# EasyEDA Pro project Ctrller v1.epro

# Schematic Controller
Board Name: Controller; Create Date: 2025-12-16; Page Name: Controller; Project Name: Renesas HandSync; Schematic Name: Controller; Update Date: 2025-12-22; BladeWidth: 10; Company: CQUPT; Drawed: WilliTourt; Page Size: A4; RegionStart: 1; Reviewed: WilliTourt; ShowBorder: 1; TitleBlock: 1; TitleBlockPosition: 3; Version: V1.0; XRegionCount: 6; YRegionCount: 4
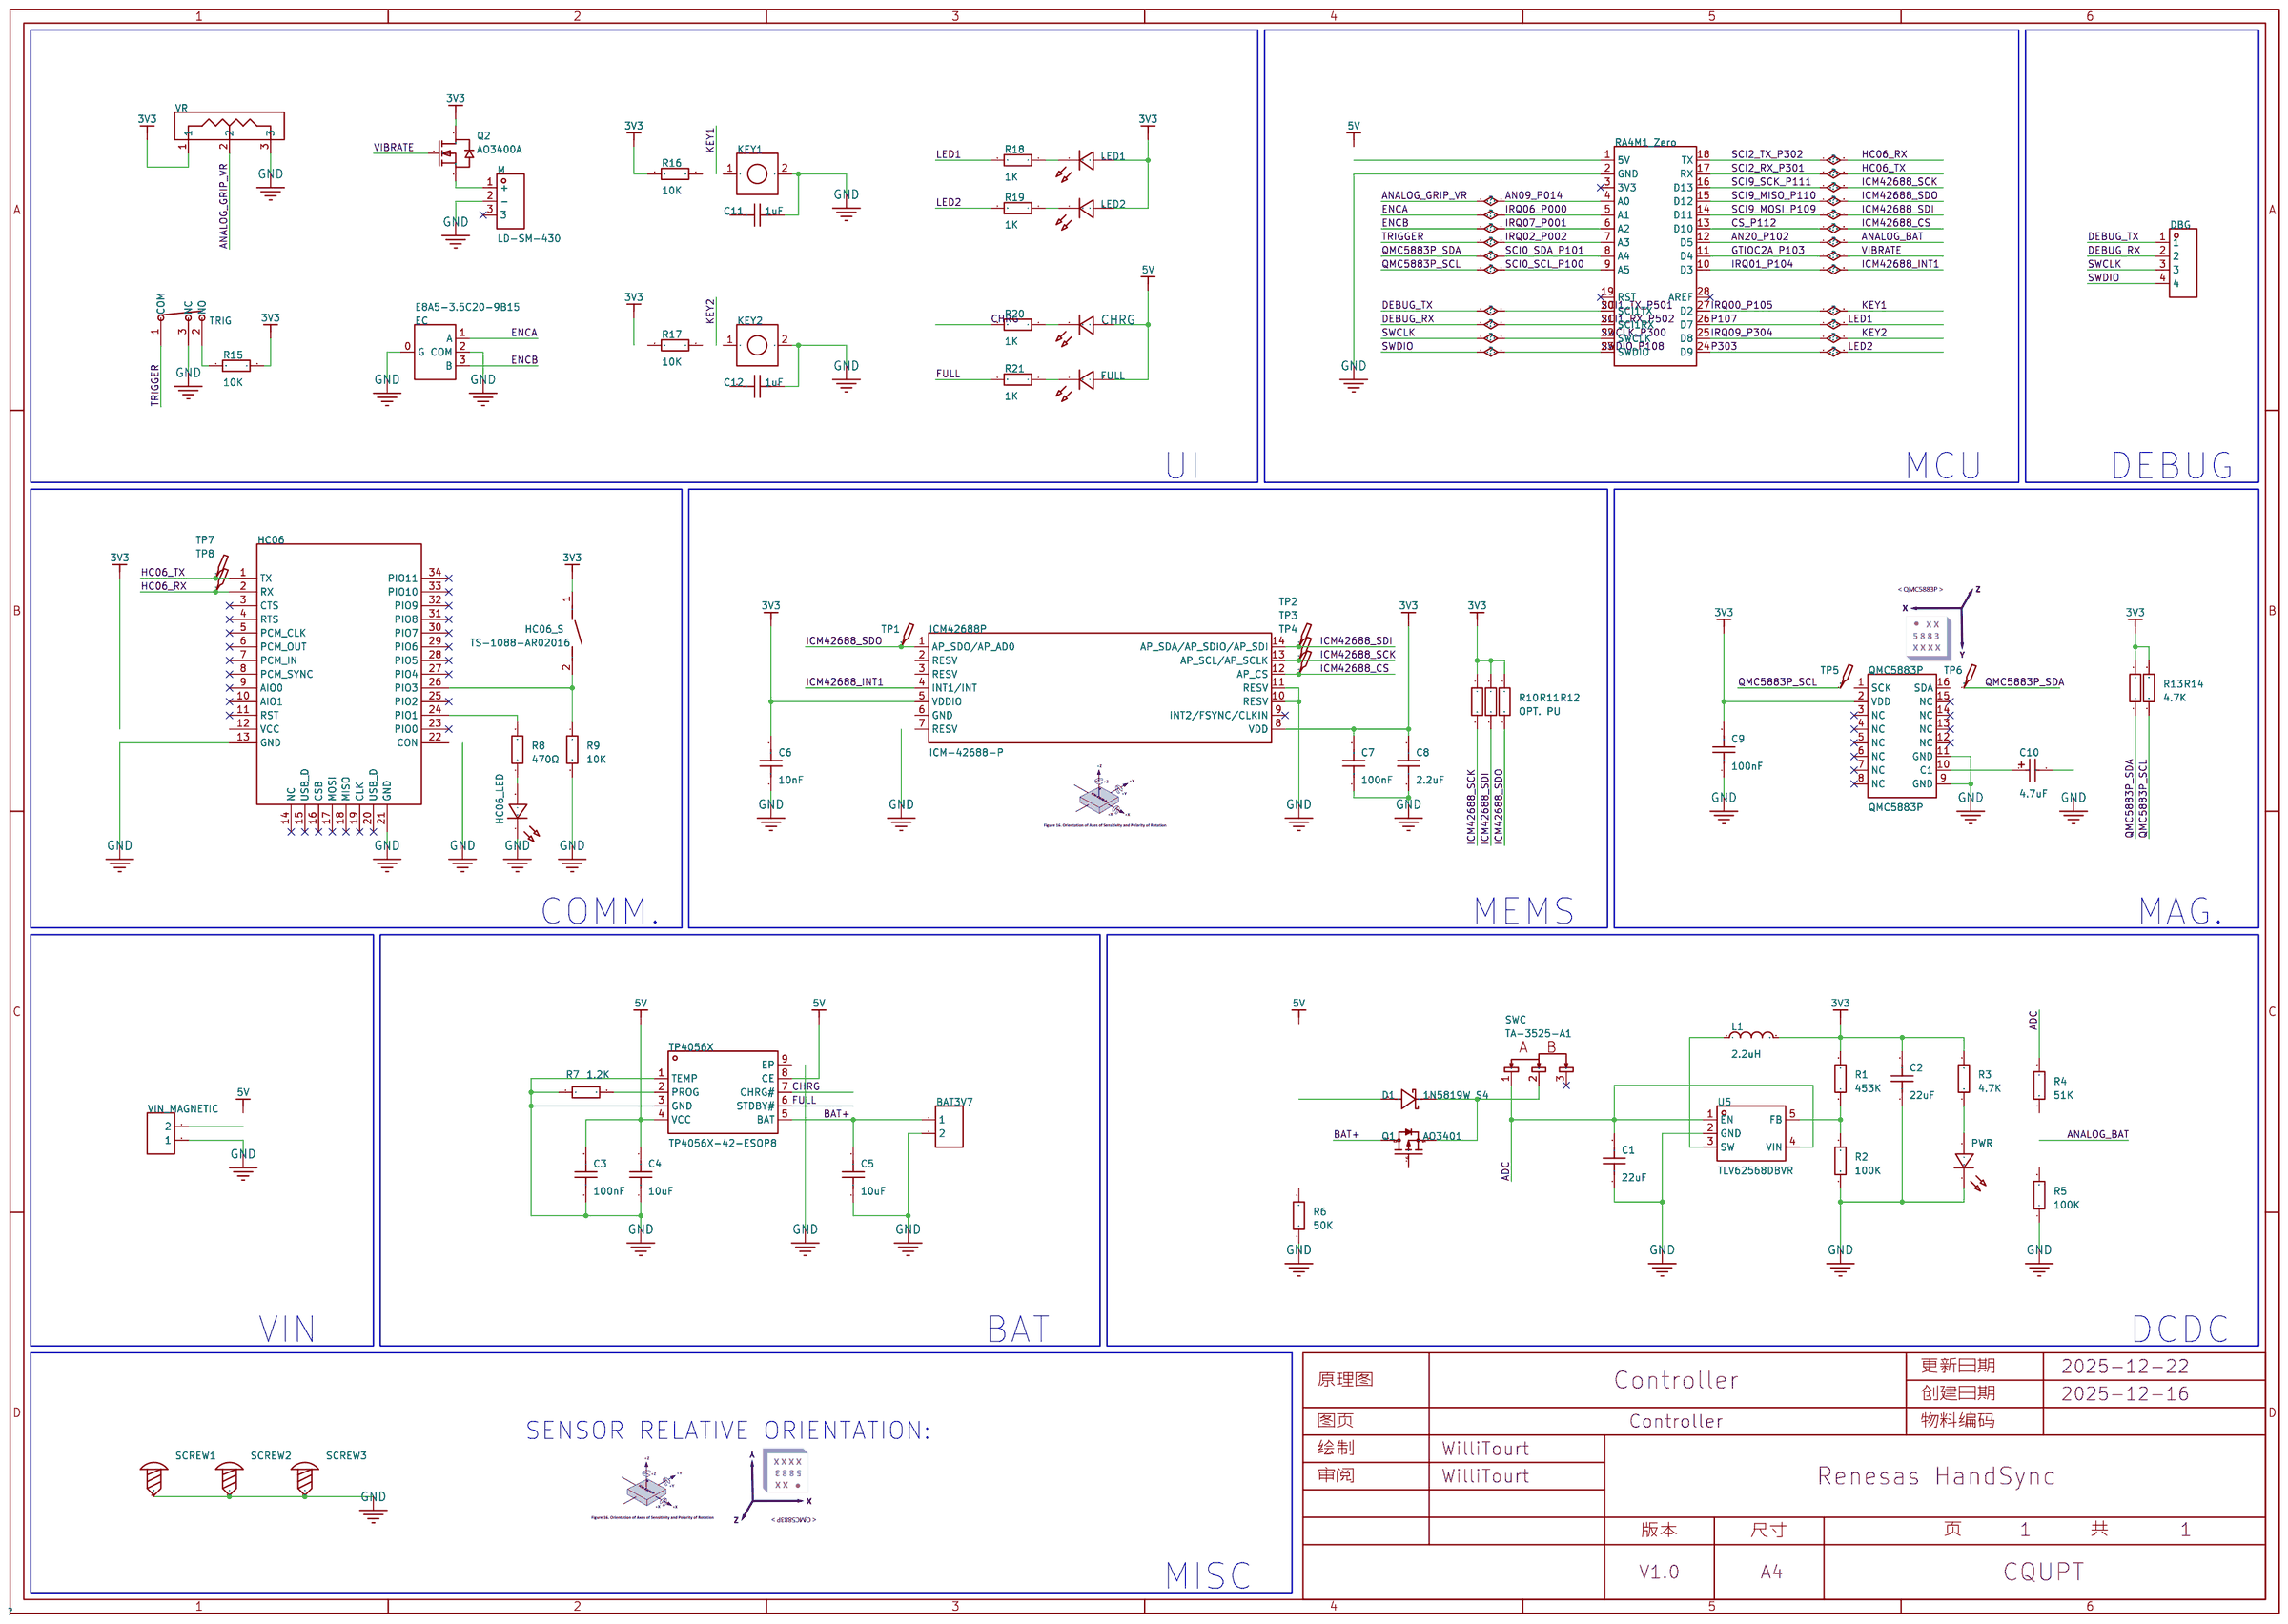
[diagram p0: schematic sheet]

## Parts
BAT3V7  -  [HDR-TH_2P-P2.54-V-F]
C1  22uF  [C0603]
C2  22uF  [C0603]
C3  100nF  [C0603]
C4  10uF  [C0603]
C5  10uF  [C0603]
C6  10nF  [C0603]
C7  100nF  [C0603]
C8  2.2uF  [C0603]
C9  100nF  [C0603]
C10  4.7uF  [CASE-A_3216]
C11  1uF  [C0603]
C12  1uF  [C0603]
CHRG  -  [LED0603]
D1  1N5819W S4  [SOD-123_L2.7-W1.6-LS3.7-RD]
DBG  -  [HDR-TH_4P-P2.54-V-F]
EC  E8A5-3.5C20-9B15  [E8A5-3.5-9-20]
FULL  -  [LED0603]
HC06  -  [HC06]
HC06_LED  -  [LED0603]
HC06_S  TS-1088-AR02016  [SW-SMD_L3.9-W3.0-P4.45]
ICM42688P  ICM-42688-P  [LGA-14_L3.0-W2.5-P0.50-TL]
KEY1  -  [6*6*5 硅胶开关]
KEY2  -  [6*6*5 硅胶开关]
L1  2.2uH  [IND-SMD_L2.5-W2.0_MHCHL2520]
LED1  -  [LED0603]
LED2  -  [LED0603]
M  LD-SM-430  [SMD_LD-SM-430-1]
PWR  -  [LED0603]
Q1  AO3401  [SOT-23-3_L2.9-W1.6-P1.90-LS2.8-BR]
Q2  AO3400A  [SOT-23-3_L2.9-W1.3-P1.90-LS2.4-BR]
QMC5883P  QMC5883P  [LGA-16_L3.0-W3.0-P0.50-BL_SQ]
R1  453K  [R0603]
R2  100K  [R0603]
R3  4.7K  [R0603]
R4  51K  [R0603]
R5  100K  [R0603]
R6  50K  [R0603]
R7  1.2K  [R0603]
R8  470Ω  [R0603]
R9  10K  [R0603]
R10  OPT. PU  [R0603]
R11  OPT. PU  [R0603]
R12  OPT. PU  [R0603]
R13  4.7K  [R0603]
R14  4.7K  [R0603]
R15  10K  [R0603]
R16  10K  [R0603]
R17  10K  [R0603]
R18  1K  [R0603]
R19  1K  [R0603]
R20  1K  [R0603]
R21  1K  [R0603]
RA4M1_Zero  -  [RA4M1-Zero]
SCREW1  -  [M2螺丝]
SCREW2  -  [M2螺丝]
SCREW3  -  [M2螺丝]
SWC  TA-3525-A1  [SW-SMD_3P-L9.1-W3.5-P2.50_BDKG-3P-H2MM]
TP1  -  [Test-Point-0.5mm]
TP2  -  [Test-Point-0.5mm]
TP3  -  [Test-Point-0.5mm]
TP4  -  [Test-Point-0.5mm]
TP5  -  [Test-Point-0.5mm]
TP6  -  [Test-Point-0.5mm]
TP7  -  [Test-Point-0.5mm]
TP8  -  [Test-Point-0.5mm]
TP4056X  TP4056X-42-ESOP8  [SOP-8_L4.9-W3.9-P1.27-LS6.0-TL-EP]
TRIG  f1be3c243c634b919f059035ed277ab7  [行程开关 引脚16.1*3.2]
U5  TLV62568DBVR  [SOT-23-5_L3.0-W1.7-P0.95-LS2.8-BR]
VIN_MAGNETIC  -  [HDR-TH_2P-P2.54-V-F]
VR  -  [Linear VR 35mm]

## Library data of the parts
BAT3V7 VIN_MAGNETIC = HDR-F_2.54_1x2P: Supplier Part: C49661; Supplier Footprint: 插件
C1-C9 C11 C12 = C0603: Supplier Footprint: 0603
C10 = TAJA475K016RNJ: 容值:4.7uF;精度:±10%;额定电压:16V;等效串联电阻(ESR):4Ω@100kHz;; LCSC Part Name: 4.7uF ±10% 16V; Supplier Part: C7187; Manufacturer: Kyocera AVX; Supplier Footprint: CASE-A-3216-18(mm); JLCPCB Part Class: 扩展库; Supplier: LCSC; Tolerance: ±10%; Voltage Rating: 16V; Equivalent Series Resistance(ESR): 4Ω@100kHz; Operating Temperature: -55℃~+125℃
CHRG = LED0603-ORANGE: Supplier Footprint: 0603
D1 = 1N5819W S4_1: Supplier Part: C42441798; Manufacturer: TDSEMIC(拓电半导体); Supplier Footprint: SOD-123FL; Datasheet: https://atta.szlcsc.com/upload/public/pdf/source/20250110/C8BCE7F7EDFAC688AB53FBC3883F650D.pdf; Supplier: LCSC
DBG = HDR-F_2.54_1x4P: Supplier Part: C2718488; Supplier Footprint: 插件
EC = E8A5-3.5-9-20
FULL PWR = LED0603-GREEN
HC06 = HC06: 蓝牙模块
HC06_LED LED1 LED2 = LED0603-WHITE
HC06_S = TS-1088-AR02016: 电路结构:单刀单掷;按钮形状:圆形按钮;作用力:1.6N;安装方式:立贴;开关长度:4mm;开关宽度:3mm;开关高度:2mm;带支架:不带支架;触点电流:50mA;额定电压:12V;工作寿命:10万次;; LCSC Part Name: 4*3*2mm 立贴 轻触开关; Supplier Part: C720477; Manufacturer: XUNPU(讯普); Supplier Footprint: SMD,4x3mm; JLCPCB Part Class: 基础库; Datasheet: https://item.szlcsc.com/datasheet/TS-1088-AR02016/763484.html; Supplier: LCSC; Circuit: 单刀单掷; Actuator Style: 圆形按钮; Operating Force: 1.6N; Mounting Type: 立贴; Length: 4mm; Width: 3mm; Switch Height: 2mm; with Bracket: 不带支架; Contact Current: 50mA; Voltage Rating: 12V; Actuator/Cap Color: 黑色; Termination Style: SMD接片; Life: 10万次; Operating Temperature: -30℃~+80℃
ICM42688P = ICM-42688-P: 传感器类型:加速度计陀螺仪;; Supplier Part: C1850418; Manufacturer: TDK InvenSense(应美盛); Supplier Footprint: LGA-14(2.5x3); JLCPCB Part Class: 扩展库; Datasheet: https://atta.szlcsc.com/upload/public/pdf/source/20210703/CF24204867ACE5B754A2B035F23E5931.pdf; Supplier: LCSC; Sensor Type: 加速度计陀螺仪
KEY1 KEY2 = 6*6*5 硅胶开关
L1 = FTC252012S2R2MBCA: 电感值:2.2uH;精度:±20%;额定电流:3A;饱和电流(Isat):3.8A;类型:一体成型电感;; LCSC Part Name: 2.2uH ±20% 3.8A; Supplier Part: C5832372; Manufacturer: cjiang(长江微电); Supplier Footprint: 1008; JLCPCB Part Class: 扩展库; Datasheet: https://atta.szlcsc.com/upload/public/pdf/source/20230602/8FFEDA9C0247A92A0D4B67554BFE4091.pdf; Supplier: LCSC; Tolerance: ±20%; Rated Current: 3A; Saturation Current (Isat): 3.8A; DC Resistance (DCR): 55mΩ; Type: 一体成型电感
M = LD-SM-430: 类型:扁平振动马达;额定电压:2.7V;额定转速:14000±2500rpm;旋转方向:CW；CCW;; Supplier Part: C41348533; Manufacturer: LEADER(立得); JLCPCB Part Class: 扩展库; Datasheet: https://item.szlcsc.com/datasheet/LD-SM-430/43080312.html; Supplier: LCSC; Type: 扁平振动马达; Voltage Rating: 2.7V; Current Rating: 85mA; Rated Speed: 14000±2500rpm; Operating Temperature: -20℃~+60℃; Sense Of Rotation: CW；CCW
Q1 = AO3401: Supplier Part: C9900008520; Supplier Footprint: SOT-23; JLCPCB Part Class: 扩展库; Supplier: LCSC
Q2 = AO3400A_C347475: 数量:1个N沟道;漏源电压(Vdss):30V;连续漏极电流(Id):5.8A;导通电阻(RDS(on)):17mΩ@10V;耗散功率(Pd):1.4W;阈值电压(Vgs(th)):1.1V@250uA;; LCSC Part Name: 1个N沟道 耐压:30V 电流:5.8A; Supplier Part: C347475; Manufacturer: UMW(友台半导体); Supplier Footprint: SOT-23; JLCPCB Part Class: 扩展库; Datasheet: https://item.szlcsc.com/datasheet/AO3400A/324135.html; Supplier: LCSC; Number: 1个N沟道; Drain to Source Voltage: 30V; Current - Continuous Drain(Id): 5.8A; RDS(on): 17mΩ@10V; Pd - Power Dissipation: 1.4W; Gate Threshold Voltage (Vgs(th)): 1.1V@250uA; Gate Charge(Qg): 9.7nC@4.5V; Input Capacitance(Ciss): 823pF; Reverse Transfer Capacitance (Crss@Vds): 77pF; Operating Temperature: -55℃~+150℃; Output Capacitance(Coss): 99pF
QMC5883P = QMC5883P: QMC5883L停产，推荐使用 C2847467 QMC5883P替代; LCSC Part Name: 三轴磁传感器; Supplier Part: C2847467; Manufacturer: QST(上海矽睿); Supplier Footprint: LGA-16(3x3); JLCPCB Part Class: 扩展库; Datasheet: https://item.szlcsc.com/datasheet/QMC5883P/3044607.html; Supplier: LCSC
R1-R21 = R0603: Supplier Footprint: 0603
RA4M1_Zero = RA4M1_Zero
SCREW1-SCREW3 = M2螺丝: Supplier Footprint: 插件
SWC = TA-3525-A1: LCSC Part Name: 滑动开关9.1*3.5*2.0mm贴片侧拨单排三脚二档; Supplier Part: C514018; Manufacturer: Yuandi(元迪); Supplier Footprint: SMD,3.5x9.1mm; JLCPCB Part Class: 扩展库; Datasheet: https://atta.szlcsc.com/upload/public/pdf/source/20200415/C514019_BD29F4555739DB2630A1255040CB70C0.pdf; Supplier: LCSC
TP1-TP8 = Test-Point: Test Point 测试点
TP4056X = TP4056X-42-ESOP8: Supplier Part: C2763448; Manufacturer: TOPPOWER(南京拓微); Supplier Footprint: SOP-8-EP; JLCPCB Part Class: 扩展库; Datasheet: https://atta.szlcsc.com/upload/public/pdf/source/20221111/3D7D53D5011BF4ED4C4D0D9BFDBB1404.pdf; Supplier: LCSC
TRIG = Travel SWC Pin16.1*3.2
U5 = TLV62568DBVR: 功能类型:降压型;输出类型:可调;工作电压:2.5V~5.5V;输出电压:600mV~5.5V;输出电流:1A;; LCSC Part Name: 1A高效同步降压转换器; Supplier Part: C163219; Manufacturer: TI(德州仪器); Supplier Footprint: SOT-23-5; JLCPCB Part Class: 扩展库; Datasheet: https://www.ti.com/cn/lit/gpn/tlv62568; Supplier: LCSC; Function: 降压型; Output Type: 可调; Input Voltage: 2.5V~5.5V; Output Voltage: 600mV~5.5V; Output Current: 1A; Switching Frequency: 1.5MHz; Operating Temperature: -40℃~+125℃@(TJ); Synchronous Rectification: 是; Number of Outputs: 1; Topology: 降压式; Switch tube (built-in/external): 内置
VR = Linear VR 35mm

## Nets
3V3: C2.2 C6.2 C7.2 C8.2 C9.2 HC06.12(VCC) HC06_S.1 ICM42688P.5(VDDIO) ICM42688P.8(VDD) L1.2 LED1.2(A) LED2.2(A) Q2.3(D) QMC5883P.2(VDD) R1.2 R3.2 R10.1 R11.1 R12.1 R13.2 R14.2 R15.2 R16.1 R17.1 VR.1
5V: C3.2 C4.2 CHRG.2(A) D1.2(A) FULL.2(A) Q1.1(G) R6.2 RA4M1_Zero.1(5V) TP4056X.4(VCC) TP4056X.8(CE) VIN_MAGNETIC.2
GND: BAT3V7.2 C1.1 C2.1 C3.1 C4.1 C5.1 C6.1 C7.1 C8.1 C9.1 C10.2 C11.1 C12.1 EC.0(G) EC.2(COM) HC06.13(GND) HC06.21(GND) HC06.22(CON) HC06_LED.1(C) ICM42688P.2(RESV) ICM42688P.3(RESV) ICM42688P.6(GND) ICM42688P.7(RESV) ICM42688P.10(RESV) ICM42688P.11(RESV) KEY1.2 KEY2.2 M.2(-) PWR.1(C) QMC5883P.9(GND) QMC5883P.11(GND) R2.1 R5.1 R6.1 R7.1 R9.2 RA4M1_Zero.2(GND) SCREW1.1 SCREW2.1 SCREW3.1 TP4056X.1(TEMP) TP4056X.3(GND) TP4056X.9(EP) TRIG.3(NC) U5.2(GND) VIN_MAGNETIC.1 VR.3
ADC: C1.2 R4.2 SWC.1 U5.1(EN) U5.4(VIN)
AN09_P014: RA4M1_Zero.4(A0) VR.2
AN20_P102: R4.1 R5.2 RA4M1_Zero.12(D5)
BAT+: BAT3V7.1 C5.2 Q1.3(D) TP4056X.5(BAT)
CHRG: R20.2 TP4056X.7(CHRG#)
CS_P112: ICM42688P.12(AP_CS) RA4M1_Zero.13(D10) TP4.1
DEBUG_RX: DBG.2 RA4M1_Zero.21(SCI1RX)
DEBUG_TX: DBG.1 RA4M1_Zero.20(SCI1TX)
ENCA: EC.1(A) RA4M1_Zero.5(A1)
ENCB: EC.3(B) RA4M1_Zero.6(A2)
FULL: R21.2 TP4056X.6(STDBY#)
GTIOC2A_P103: Q2.1(G) RA4M1_Zero.11(D4)
HC06_RX: HC06.2(RX) RA4M1_Zero.18(TX) TP8.1
HC06_TX: HC06.1(TX) RA4M1_Zero.17(RX) TP7.1
ICM42688_INT1: ICM42688P.4(INT1/INT) RA4M1_Zero.10(D3)
ICM42688_SCK: ICM42688P.13(AP_SCL/AP_SCLK) R12.2 RA4M1_Zero.16(D13) TP3.1
ICM42688_SDI: ICM42688P.14(AP_SDA/AP_SDIO/AP_SDI) R11.2 RA4M1_Zero.14(D11) TP2.1
ICM42688_SDO: ICM42688P.1(AP_SDO/AP_AD0) R10.2 RA4M1_Zero.15(D12) TP1.1
IRQ00_P105: C11.2 KEY1.1 R16.2 RA4M1_Zero.27(D2)
IRQ02_P002: RA4M1_Zero.7(A3) TRIG.1(COM)
IRQ09_P304: C12.2 KEY2.1 R17.2 RA4M1_Zero.25(D8)
LED1: R18.2 RA4M1_Zero.26(D7)
LED2: R19.2 RA4M1_Zero.24(D9)
QMC5883P_SCL: QMC5883P.1(SCK) R13.1 RA4M1_Zero.9(A5) TP5.1
QMC5883P_SDA: QMC5883P.16(SDA) R14.1 RA4M1_Zero.8(A4) TP6.1
SWCLK: DBG.3 RA4M1_Zero.22(SWCLK)
SWDIO: DBG.4 RA4M1_Zero.23(SWDIO)
$1N4731: HC06.26(PIO3) HC06_S.2 R9.1
$1N4735: HC06.24(PIO1) R8.2
$1N6031: D1.1(C) Q1.2(S) SWC.2
$1N6033: PWR.2(A) R3.1
$1N6047: FULL.1(C) R21.1
$1N6048: CHRG.1(C) R20.1
$1N14788: R15.1 TRIG.2(NO)
$1N15083: LED2.1(C) R19.1
$1N15087: LED1.1(C) R18.1
$1N22954: M.1(+) Q2.2(S)
Net-(C10-1): C10.1 QMC5883P.10(C1)
Net-(HC06_LED-2): HC06_LED.2(A) R8.1
Net-(L1-1): L1.1 U5.3(SW)
Net-(R1-1): R1.1 R2.2 U5.5(FB)
Net-(R7-2): R7.2 TP4056X.2(PROG)

Not connected (* = marked no-connect by the designer): HC06 3(CTS)* 4(RTS)* 5(PCM_CLK)* 6(PCM_OUT)* 7(PCM_IN)* 8(PCM_SYNC)* 9(AIO0)* 10(AIO1)* 11(RST)* 14(NC)* 15(USB_D)* 16(CSB)* 17(MOSI)* 18(MISO)* 19(CLK)* 20(USB_D)* 23(PIO0)* 25(PIO2)* 27(PIO4)* 28(PIO5)* 29(PIO6)* 30(PIO7)* 31(PIO8)* 32(PIO9)* 33(PIO10)* 34(PIO11)*; ICM42688P 9(INT2/FSYNC/CLKIN)*; M 3*; QMC5883P 3(NC)* 4(NC)* 5(NC)* 6(NC)* 7(NC)* 8(NC)* 12(NC)* 13(NC)* 14(NC)* 15(NC)*; RA4M1_Zero 3(3V3)* 19(RST)* 28(AREF)*; SWC 3*

## Notes on the sheet
- UI
- MCU
- DEBUG
- COMM.
- MEMS
- MAG.
- VIN
- BAT
- DCDC
- SENSOR RELATIVE ORIENTATION:
- MISC

# Board Controller
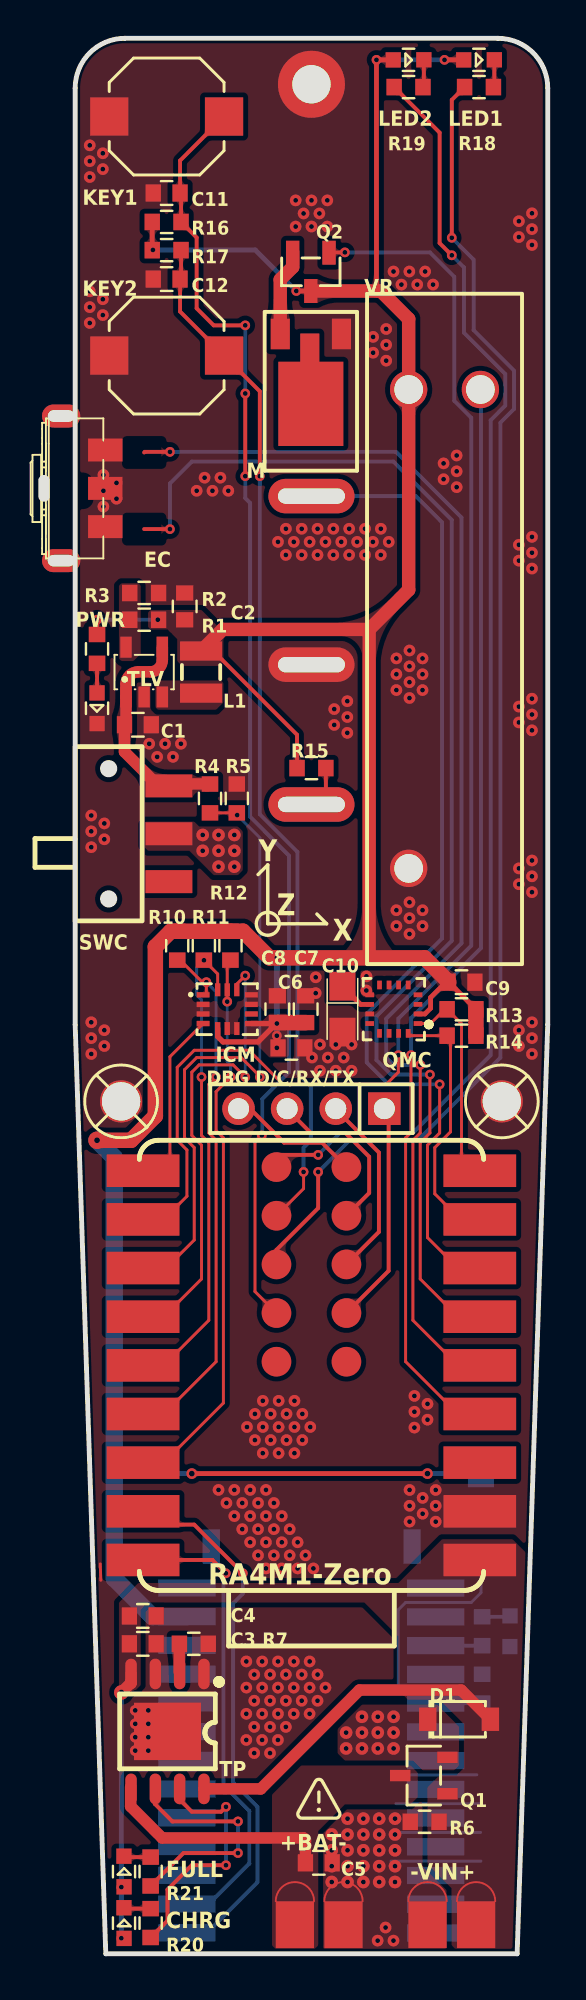
[diagram p1: board, top side]
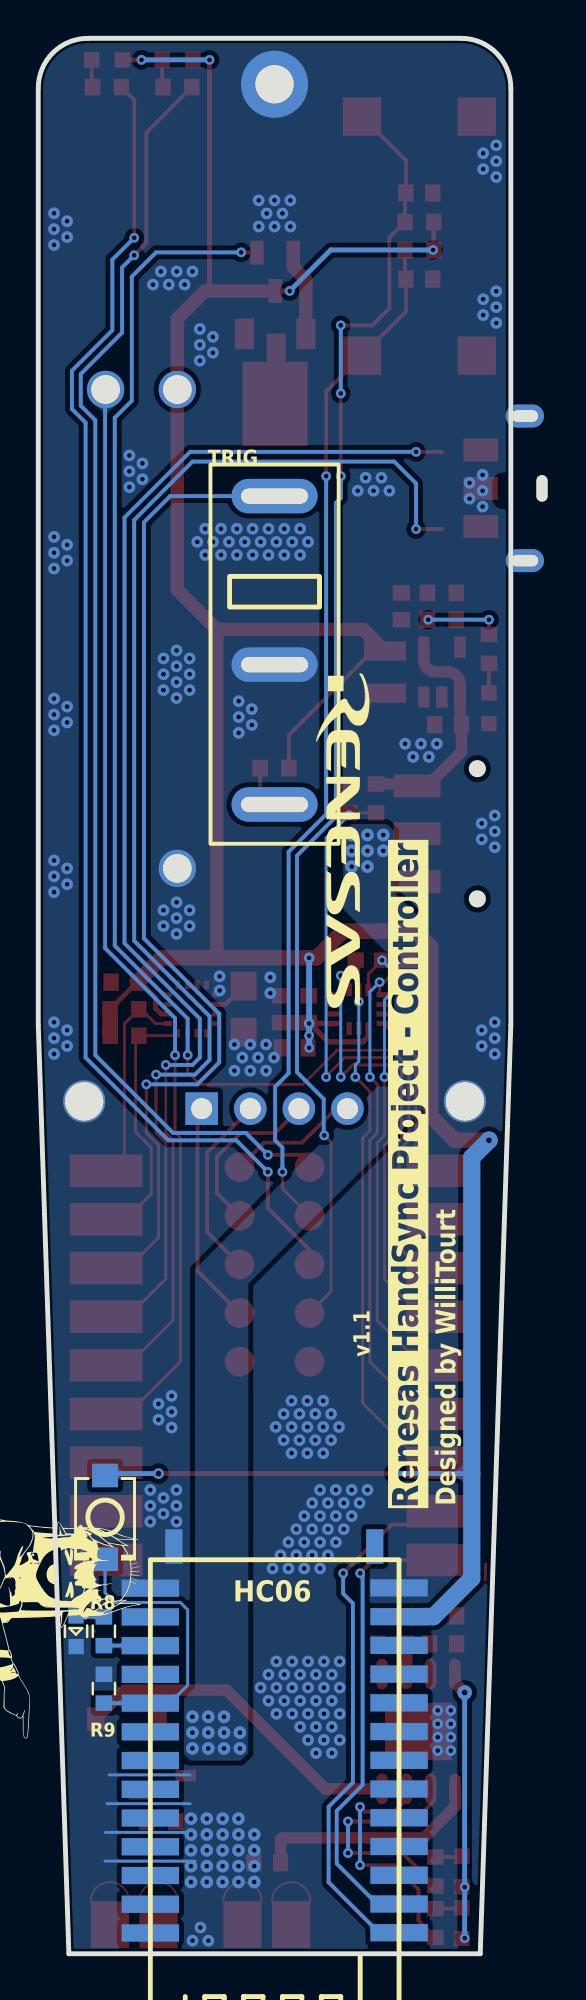
[diagram p2: board, bottom side, seen from below]

Outline 26.63 x 100 mm; copper layers: Top Layer, Bottom Layer. Coordinates in mm from the lower left corner of the outline.
Outline path: 1.93,97.4 arc(2.69,99.24) 4.53,100 24.03,100 arc(25.87,99.24) 26.63,97.4 26.63,48.5 25.03,0 3.53,0 1.93,48.5 1.93,97.4
Stack: Top Layer 0.035mm / Dielectric1 1.51mm FR4 er 4.5 / Bottom Layer 0.035mm

## Design rules (mm)
spacing copperThickness1oz (default): track to track 0.102, other pairs 0.152 to 0.3
spacing copperThickness2oz: track to track 0.203, other pairs 0.152 to 0.3
spacing Plane_innerPlane: track to track 0.102, other pairs 0.152 to 0.3
spacing Copper_copperRegion: track to track 0.102, other pairs 0.152 to 0.3
track width copperThickness1oz (default): min 0.102, default 0.203, max 2.54
track width copperThickness2oz: min 0.203, default 0.254, max 2.54
differential pair differentialPair (default): width min 0.127, default 0.254, max 2.54; gap min 0.152, default 0.152
pour e740 uses Copper_copperRegion
pour e742 uses Copper_copperRegion
pour e744 uses Copper_copperRegion
pour e746 uses Copper_copperRegion
pour e748 uses Copper_copperRegion
pour e750 uses Copper_copperRegion
pour e752 uses Copper_copperRegion
pour e754 uses Copper_copperRegion
pour e756 uses Copper_copperRegion
pour e758 uses Copper_copperRegion
pour e763 uses Copper_copperRegion

## Placement (name value [footprint] x y rotation side)
+BAT-  -  [HDR-TH_2P-P2.54-V-F]  14.68 2.02 0 top
-VIN+  -  [HDR-TH_2P-P2.54-V-F]  21.61 2.02 0 top
C1  22uF  [C0603]  5.21 64.16 180 top
C2  22uF  [C0603]  7.65 70.34 270 top
C3  100nF  [C0603]  5.46 16.18 180 top
C4  10uF  [C0603]  5.46 17.64 180 top
C5  10uF  [C0603]  14.66 4.75 180 top
C6  10nF  [C0603]  13.23 47.3 180 top
C7  100nF  [C0603]  13.98 49.31 270 top
C8  2.2uF  [C0603]  12.5 49.31 270 top
C9  100nF  [C0603]  22.12 50.72 180 top
C10  4.7uF  [CASE-A_3216]  15.9 49.31 270 top
C11  1uF  [C0603]  6.71 91.92 0 top
C12  1uF  [C0603]  6.71 87.43 0 top
CHRG  -  [LED0603]  4.49 1.55 270 top
D1  1N5819W S4  [SOD-123_L2.7-W1.6-LS3.7-RD]  22 12.24 0 top
DBG D/C/RX/TX  -  [HDR-TH_4P-P2.54-V-F]  14.28 44.12 180 top
EC  E8A5-3.5C20-9B15  [E8A5-3.5-9-20]  3.23 76.38 90 top
FULL  -  [LED0603]  4.49 4.24 270 top
HC06  -  [HC06]  7.77 -6.43 0 bottom
HC06_S  TS-1088-AR02016  [SW-SMD_L3.9-W3.0-P4.45]  23.14 22.78 270 bottom
ICM  ICM-42688-P  [LGA-14_L3.0-W2.5-P0.50-TL]  9.88 49.31 0 top
KEY1  -  [6*6*5 硅胶开关]  6.71 95.92 180 top
KEY2  -  [6*6*5 硅胶开关]  6.71 83.44 180 top
L1  2.2uH  [IND-SMD_L2.5-W2.0_MHCHL2520]  8.51 66.91 90 top
LED  -  [LED0603]  24.66 16.89 90 bottom
LED1  -  [LED0603]  22.99 98.87 180 top
LED2  -  [LED0603]  19.3 98.87 180 top
M  LD-SM-430  [SMD_LD-SM-430-1]  14.25 83.11 0 top
PWR  -  [LED0603]  3.07 65.08 90 top
Q1  AO3401  [SOT-23-3_L2.9-W1.6-P1.90-LS2.8-BR]  20.15 9.3 0 top
Q2  AO3400A  [SOT-23-3_L2.9-W1.3-P1.90-LS2.4-BR]  14.25 87.81 90 top
QMC  QMC5883P  [LGA-16_L3.0-W3.0-P0.50-BL_SQ]  18.59 49.31 90 top
R1  453K  [R0603]  5.53 69.65 0 top
R2  100K  [R0603]  5.53 71.04 180 top
R3  4.7K  [R0603]  3.07 68.12 90 top
R4  51K  [R0603]  8.98 60.31 90 top
R5  100K  [R0603]  10.38 60.31 270 top
R6  50K  [R0603]  20.19 6.89 0 top
R7  1.2K  [R0603]  8.13 16.18 180 top
R8  470Ω  [R0603]  23.2 16.84 270 bottom
R9  10K  [R0603]  23.2 13.84 90 bottom
R10  OPT. PU  [R0603]  7.26 52.63 270 top
R11  OPT. PU  [R0603]  8.65 52.63 270 top
R12  OPT. PU  [R0603]  10.05 52.63 270 top
R13  4.7K  [R0603]  22.12 49.31 0 top
R14  4.7K  [R0603]  22.12 47.93 0 top
R15  10K  [R0603]  14.28 61.9 180 top
R16  10K  [R0603]  6.71 90.41 0 top
R17  10K  [R0603]  6.71 88.94 0 top
R18  1K  [R0603]  23.04 97.45 180 top
R19  1K  [R0603]  19.35 97.45 180 top
R20  1K  [R0603]  5.87 1.6 270 top
R21  1K  [R0603]  5.87 4.29 270 top
RA4M1-Zero  -  [RA4M1-Zero]  23.28 42.47 180 top
SCREW1  -  [M2螺丝#2]  4.33 44.5 0 top
SCREW2  -  [M2螺丝#2]  24.23 44.5 0 top
SCREW3  -  [M2螺丝]  14.28 97.6 0 top
SWC  TA-3525-A1  [SW-SMD_3P-L9.1-W3.5-P2.50_BDKG-3P-H2MM]  6.83 58.47 270 top
TLV  TLV62568DBVR  [SOT-23-5_L3.0-W1.7-P0.95-LS2.8-BR]  5.53 66.91 270 top
TP  TP4056X-42-ESOP8  [SOP-8_L4.9-W3.9-P1.27-LS6.0-TL-EP]  6.75 11.61 270 top
TP1  -  [Test-Point-0.5mm]  5.48 28.18 0 top
TP2  -  [Test-Point-0.5mm]  5.48 30.72 0 top
TP3  -  [Test-Point-0.5mm]  5.48 25.64 0 top
TP4  -  [Test-Point-0.5mm]  5.48 33.26 0 top
TP5  -  [Test-Point-0.5mm]  23.08 40.88 0 top
TP6  -  [Test-Point-0.5mm]  23.08 38.34 0 top
TP7  -  [Test-Point-0.5mm]  5.48 23.1 0 top
TP8  -  [Test-Point-0.5mm]  5.48 20.56 0 top
TRIG  f1be3c243c634b919f059035ed277ab7  [行程开关 引脚16.1*3.2]  17.63 77.75 270 bottom
VR  -  [Linear VR 35mm]  17.19 86.67 270 top

## Footprints (pads in the part's own frame, mm; a bottom-side part is the same pattern mirrored in y, then rotated)
6*6*5 硅胶开关
  rect 2x2 smd: 1(-2.999,-0.002) 2(3.001,-0.002)
C0603
  rect 0.8x0.9 smd: 1(-0.7,0) 2(0.7,0)
CASE-A_3216
  rect 1.5x1.359 smd: 1(-1.2,0) 2(1.2,0)
E8A5-3.5-9-20
  oval 1.2x2 hole 0.6x1.4: 0(-3.647,2.038) 0(3.903,2.038)
  rect 1.2x1.8 smd: 1(2.127,-0.269) 2(0.127,-0.269) 3(-1.873,-0.269)
HC06
  rect 3x0.9 smd: 1(0,-7.526) 2(0,-9.025) 3(0,-10.525) 4(0,-12.025) 5(0,-13.525) 6(0,-15.025) 7(0,-16.526) 8(0,-18.026) 9(0,-19.526) 10(0,-21.026) 11(0,-22.526) 12(0,-24.026) 13(0,-25.526) 22(13,-25.512) 23(13,-24.012) 24(13,-22.512) 25(13,-21.012) 26(13,-19.512) 27(13,-18.012) 28(13,-16.512) 29(13,-15.011) 30(13,-13.511) 31(13,-12.011) 32(13,-10.511) 33(13,-9.011) 34(13,-7.511)
  rect 0.9x1.8 smd: 14(1.27,-27.686) 21(11.77,-27.686)
HDR-TH_2P-P2.54-V-F
  custom 2x3.443 smd: 1(-1.27,0) 2(1.27,0)
HDR-TH_4P-P2.54-V-F
  rect 1.7x1.7 hole 1.1: 1(-3.81,0)
  round 1.7 hole 1.1: 2(-1.27,0) 3(1.27,0) 4(3.81,0)
IND-SMD_L2.5-W2.0_MHCHL2520
  rect 1x2.2 smd: 1(-1.1,0) 2(1.1,0)
LED0603
  rect 0.8x0.8 smd: 1(-0.851,-0.01) 2(0.75,-0.005)
LGA-14_L3.0-W2.5-P0.50-TL
  rect 0.675x0.28 smd: 1(-1.262,0.75) 2(-1.262,0.25) 3(-1.262,-0.25) 4(-1.262,-0.75) 8(1.262,-0.75) 9(1.262,-0.25) 10(1.262,0.25) 11(1.262,0.75)
  rect 0.28x0.675 smd: 5(-0.5,-1.012) 6(0,-1.012) 7(0.5,-1.012) 12(0.5,1.012) 13(0,1.012) 14(-0.5,1.012)
LGA-16_L3.0-W3.0-P0.50-BL_SQ
  rect 0.25x0.45 smd: 1(-0.75,-1.263) 2(-0.25,-1.263) 3(0.25,-1.263) 4(0.75,-1.263) 9(0.75,1.263) 10(0.25,1.263) 11(-0.25,1.263) 12(-0.75,1.263)
  rect 0.45x0.25 smd: 5(1.263,-0.75) 6(1.263,-0.25) 7(1.263,0.25) 8(1.263,0.75) 13(-1.263,0.75) 14(-1.263,0.25) 15(-1.263,-0.25) 16(-1.263,-0.75)
Linear VR 35mm
  round 1.95 hole 1.5x1.25: 1(5,2.175) 2(5,5.925) 3(30,2.175)
M2螺丝
  round 3.5 hole 2: 1(0,0)
M2螺丝#2
  round 2.2 hole 2: 1(0,0)
R0603
  rect 0.806x0.864 smd: 1(-0.753,0) 2(0.753,0)
RA4M1-Zero
  rect 3.8x1.7 smd: 1(0.2,21.91) 2(0.2,19.37) 3(0.2,16.83) 4(0.2,14.29) 5(0.2,11.75) 6(0.2,9.21) 7(0.2,6.67) 8(0.2,4.13) 9(0.2,1.59) 10(17.8,1.59) 11(17.8,4.13) 12(17.8,6.67) 13(17.8,9.21) 14(17.8,11.75) 15(17.8,14.29) 16(17.8,16.83) 17(17.8,19.37) 18(17.8,21.91)
  round 1.55 smd: 19(7.172,11.56) 20(7.172,9.02) 21(7.172,6.48) 22(7.172,3.94) 23(7.172,1.4) 24(10.828,1.4) 25(10.828,3.94) 26(10.828,6.48) 27(10.828,9.02) 28(10.828,11.56)
SMD_LD-SM-430-1
  custom 1x1.6 smd: 1(-1.6,1.456) 2(1.6,1.456)
  custom 3.4x5.873 smd: 3(0,-1.456)
SOD-123_L2.7-W1.6-LS3.7-RD
  rect 0.91x1.22 smd: 1(-1.635,0) 2(1.635,0)
SOP-8_L4.9-W3.9-P1.27-LS6.0-TL-EP
  oval 1.6x0.6 smd: 1(-3,1.905) 2(-3,0.635) 3(-3,-0.635) 4(-3,-1.905) 5(3,-1.905) 6(3,-0.635) 7(3,0.635) 8(3,1.905)
  rect 3x3.5 smd: 9(0,0)
SOT-23-3_L2.9-W1.3-P1.90-LS2.4-BR
  rect 1.25x0.7 smd: 1(1,-0.95) 2(1,0.95) 3(-1,0)
SOT-23-3_L2.9-W1.6-P1.90-LS2.8-BR
  rect 1.07x0.6 smd: 1(1.235,-0.95) 2(1.235,0.95) 3(-1.235,0)
SOT-23-5_L3.0-W1.7-P0.95-LS2.8-BR
  rect 1.1x0.6 smd: 1(1.3,-0.95) 2(1.3,0) 3(1.3,0.95) 4(-1.3,0.95) 5(-1.3,-0.95)
SW-SMD_3P-L9.1-W3.5-P2.50_BDKG-3P-H2MM
  rect 1.2x2.45 smd: 1(-2.5,0) 2(0,0) 3(2.5,0)
SW-SMD_L3.9-W3.0-P4.45
  rect 1.23x1.36 smd: 1(-2.185,0) 2(2.185,0)
Test-Point-0.5mm
  round 0.5 smd: 1(0,0)
行程开关 引脚16.1*3.2
  oval 1.8x4.5 hole 0.8x3.5: 1(1.65,3.35) 2(17.75,3.35) 3(10.45,3.35)

## Nets
3V3: C2.2 C6.2 C7.2 C8.2 C9.2 HC06.12 HC06_S.1 ICM.5 ICM.8 L1.2 LED1.2 LED2.2 Q2.3 QMC.2 R1.2 R3.2 R10.1 R11.1 R12.1 R13.2 R14.2 R15.2 R16.1 R17.1 VR.1
5V: -VIN+.2 C3.2 C4.2 CHRG.2 D1.2 FULL.2 Q1.1 R6.2 RA4M1-Zero.1 TP.4 TP.8
GND: +BAT-.2 -VIN+.1 C1.1 C2.1 C3.1 C4.1 C5.1 C6.1 C7.1 C8.1 C9.1 C10.2 C11.1 C12.1 EC.0 EC.2 HC06.13 HC06.21 HC06.22 ICM.2 ICM.3 ICM.6 ICM.7 ICM.10 ICM.11 KEY1.2 KEY2.2 LED.1 M.2 PWR.1 QMC.9 QMC.11 R2.1 R5.1 R6.1 R7.1 R9.2 RA4M1-Zero.2 SCREW1.1 SCREW2.1 SCREW3.1 TLV.2 TP.1 TP.3 TP.9 TRIG.3 VR.3
ADC: C1.2 R4.2 SWC.1 TLV.1 TLV.4
AN09_P014: RA4M1-Zero.4 VR.2
AN20_P102: R4.1 R5.2 RA4M1-Zero.12
BAT+: +BAT-.1 C5.2 Q1.3 TP.5
CHRG: R20.2 TP.7
CS_P112: ICM.12 RA4M1-Zero.13 TP4.1
DEBUG_RX: DBG D/C/RX/TX.2 RA4M1-Zero.21
DEBUG_TX: DBG D/C/RX/TX.1 RA4M1-Zero.20
ENCA: EC.1 RA4M1-Zero.5
ENCB: EC.3 RA4M1-Zero.6
FULL: R21.2 TP.6
GTIOC2A_P103: Q2.1 RA4M1-Zero.11
HC06_RX: HC06.2 RA4M1-Zero.18 TP8.1
HC06_TX: HC06.1 RA4M1-Zero.17 TP7.1
ICM42688_INT1: ICM.4 RA4M1-Zero.10
ICM42688_SCK: ICM.13 R12.2 RA4M1-Zero.16 TP3.1
ICM42688_SDI: ICM.14 R11.2 RA4M1-Zero.14 TP2.1
ICM42688_SDO: ICM.1 R10.2 RA4M1-Zero.15 TP1.1
IRQ00_P105: C11.2 KEY1.1 R16.2 RA4M1-Zero.27
IRQ02_P002: RA4M1-Zero.7 TRIG.1
IRQ09_P304: C12.2 KEY2.1 R17.2 RA4M1-Zero.25
LED1: R18.2 RA4M1-Zero.26
LED2: R19.2 RA4M1-Zero.24
QMC5883P_SCL: QMC.1 R13.1 RA4M1-Zero.9 TP5.1
QMC5883P_SDA: QMC.16 R14.1 RA4M1-Zero.8 TP6.1
SWCLK: DBG D/C/RX/TX.3 RA4M1-Zero.22
SWDIO: DBG D/C/RX/TX.4 RA4M1-Zero.23
$1N2884: C10.1 QMC.10
$1N4731: HC06.26 HC06_S.2 R9.1
$1N4735: HC06.24 R8.2
$1N4784: LED.2 R8.1
$1N6030: L1.1 TLV.3
$1N6031: D1.1 Q1.2 SWC.2
$1N6032: R1.1 R2.2 TLV.5
$1N6033: PWR.2 R3.1
$1N6047: FULL.1 R21.1
$1N6048: CHRG.1 R20.1
$1N6051: R7.2 TP.2
$1N14788: R15.1 TRIG.2
$1N15083: LED2.1 R19.1
$1N15087: LED1.1 R18.1
$1N22954: M.1 Q2.2

Pads without a net: HC06 3 4 5 6 7 8 9 10 11 14 23 25 27 28 29 30 31 32 33 34; ICM 9; M 3; QMC 3 4 5 6 7 8 12 13 14 15; RA4M1-Zero 3 19 28; SWC 3

## Via types
v1: diameter 0.61, hole 0.254, Top Layer to Bottom Layer, 238 vias
v2: diameter 0.66, hole 0.254, Top Layer to Bottom Layer, 43 vias
v3: diameter 0.559, hole 0.254, Top Layer to Bottom Layer, 10 vias
v4: diameter 0.508, hole 0.254, Top Layer to Bottom Layer, 44 vias
v5: diameter 0.559, hole 0.305, Top Layer to Bottom Layer, 2 vias
v6: diameter 0.914, hole 0.305, Top Layer to Bottom Layer, 1 via
v7: diameter 0.762, hole 0.305, Top Layer to Bottom Layer, 1 via

## Routing (per net, layer and track width the routed paths; a pad name or vN(x,y) marks a point on that pad's centre or on a via; arc(x,y) is an arc through that point)
3V3: length 183.6
  Top Layer w0.203: L1.2 9.15,68.01 13.53,63.64 R15.2 ; R3.2 v4(3.07,69.65)
  Top Layer w0.249: 21.42,50.72 21.31,50.72 20.51,49.92 20.51,49.36 20.21,49.06 QMC.2
  Top Layer w0.254: R17.1 R16.1 ; 17.68,86.81 v4(17.68,98.88) 18.55,98.88 ; v5(8.03,25.07) v5(20.34,25.07) ; 22.24,98.88 v4(21.23,98.88) ; Q2.3 v4(13.49,86.81) ; 21.42,50.72 21.46,50.72 R13.2
  Top Layer w0.28: ICM.5 9.38,47.89 9.66,47.61 11.49,47.61 12.44,48.56 ICM.8
  Top Layer w0.701: 17.32,51.99 17.3,52.01 17.3,69.14 ; 17.3,69.14 9.64,69.14 L1.2 ; 17.3,69.14 19.36,71.2 19.36,85.35 17.9,86.81 Q2.3
  Top Layer w0.807: 21.46,50.72 20.19,51.99 v3(12.47,51.99) 12.09,51.99 10.7,53.38 R12.1 R11.1 R10.1 6.93,53.38 6.12,52.57 6.12,43.74 4.85,42.47 v6(3.07,42.47) ; C7.2 C8.2 ; R13.2 R14.2
  Bottom Layer w0.203: v4(3.07,69.65) v4(6.25,69.65)
  Bottom Layer w0.254: v4(13.49,86.81) 11.34,88.95 v4(5.99,88.95) ; v4(21.23,98.88) v4(17.68,98.88) ; 3.97,25.07 v5(8.03,25.07) ; HC06_S.1 23.04,25.07 v5(20.34,25.07)
  Bottom Layer w0.305: v4(12.47,47.3) v4(12.47,47.93) v3(12.47,48.56) v3(12.47,51.99)
  Bottom Layer w0.899: v6(3.07,42.47) 3.97,41.57 3.97,19.6 5.97,17.6 HC06.12
5V: length 31.7
  Top Layer w0.6: v7(4.34,13.64) 4.85,14.15 TP.4 ; D1.2 22.11,13.77 16.79,13.77 11.63,8.61 TP.8
  Bottom Layer w0.254: v4(4.34,0.81) v4(4.34,3.48) v7(4.34,13.64)
GND: length 18.7
  Top Layer w0.152: 3.24,20.35 3.27,19.5
  Bottom Layer w0.152: 18.65,6.18 v2(18.65,6.23) 18.75,6.34 23.12,6.34 ; 23.04,7.84 18.69,7.84 ; 23.14,4.84 18.44,4.84 ; 22.92,9.34 18.69,9.34
  vias: v1(2.69,94.41) v1(2.69,93.58) v1(2.69,92.76) v1(2.69,86.79) v1(2.69,85.97) v1(2.69,85.14) v1(2.77,59.42) v1(2.77,58.6) v1(2.77,57.77) v1(2.77,48.63) v1(2.77,47.8) v1(2.77,46.98) v1(3.37,94) v1(3.37,93.17) v1(3.37,86.38) v1(3.37,85.55) v1(3.4,77.2) v1(3.4,76.38) v1(3.4,75.55) v1(3.45,59.01) v1(3.45,58.18) v1(3.45,48.22) v1(3.45,47.39) v1(4.09,76.79) v1(4.09,75.96) v1(5.8,63.17) v1(6.21,62.49) v1(6.63,63.17) v1(7.04,62.49) v1(7.46,63.17) v1(8.28,76.38) v1(8.69,77.06) v1(9.11,76.38) v1(9.42,24.22) v1(9.52,77.06) v1(9.84,23.53) v1(9.93,76.38) v1(10.25,24.22) v1(10.25,22.85) v1(10.66,23.53) v1(10.66,22.17) v1(10.88,15.26) v1(10.88,13.89) v1(10.87,12.53) v1(10.87,11.16) v1(10.91,27.5) v1(11.08,24.22) v1(11.07,22.85) v1(11.07,21.48) v1(11.32,28.18) v1(11.32,26.82) v1(11.29,14.58) v1(11.29,13.21) v1(11.29,11.84) v1(11.29,10.48) v1(11.49,23.53) v1(11.49,22.17) v1(11.49,20.8) v1(11.74,28.87) v1(11.74,27.5) v1(11.74,26.13) v1(11.7,15.26) v1(11.7,13.89) v1(11.7,12.53) v1(11.7,11.16) v1(11.9,24.22) v1(11.9,22.85) v1(11.9,21.48) v1(11.9,20.12) v1(12.15,28.18) v1(12.15,26.82) v1(12.12,14.58) v1(12.12,13.21) v1(12.11,11.84) v1(12.11,10.48) v1(12.32,23.53) v1(12.31,22.17) v1(12.31,20.8) v1(12.53,73.71) v1(12.56,28.87) v1(12.56,27.5) v1(12.56,26.13) v1(12.53,15.26) v1(12.53,13.89) v1(12.53,12.53) v1(12.53,11.16) v1(12.73,22.85) v1(12.73,21.48) v1(12.73,20.12) v1(12.94,74.39) v1(12.94,73.03) v1(12.98,28.18) v1(12.98,26.82) v1(12.94,14.58) v1(12.94,13.21) v1(12.94,11.84) v1(13.14,22.17) v1(13.14,20.8) v1(13.36,73.71) v1(13.36,15.26) v1(13.36,13.89) v1(13.35,12.53) v1(13.45,91.54) v1(13.45,90.17) v1(13.39,28.87) v1(13.39,27.5) v1(13.39,26.13) v1(13.56,21.48) v1(13.55,20.12) v1(13.77,74.39) v1(13.77,73.03) v1(13.77,14.58) v1(13.77,13.21) v1(13.87,90.86) v1(13.8,28.18) v1(13.8,26.82) v1(13.97,20.8) v1(14.18,73.71) v1(14.22,27.5) v1(14.18,15.26) v1(14.18,13.89) v1(14.18,12.53) v1(14.28,91.54) v1(14.28,90.17) v1(14.31,46.79) v1(14.38,20.12) v1(14.5,50.98) v1(14.5,50.15) v1(14.6,74.39) v1(14.6,73.03) v1(14.6,14.58) v1(14.6,13.21) v1(14.69,90.86) v1(14.72,47.47) v1(14.72,46.1) v1(15.01,73.71) v1(15.01,13.89) v1(15.11,91.54) v1(15.11,90.17) v1(15.14,46.79) v1(15.42,74.39) v1(15.42,73.03) v1(15.47,64.98) v1(15.47,64.15) v1(15.55,47.47) v1(15.55,46.1) v1(15.84,73.71) v1(15.96,46.79) v1(16.15,65.39) v1(16.15,64.57) v1(16.15,63.74) v1(16.25,74.39) v1(16.25,73.03) v1(16.38,47.47) v1(16.38,46.1) v1(16.66,73.71) v1(17.08,74.39) v1(17.08,73.03) v1(17.15,51.03) v1(17.15,50.29) v1(17.5,84.41) v1(17.5,83.58) v1(17.49,73.71) v1(17.74,0.69) v1(17.91,74.39) v1(17.9,73.03) v1(18.15,1.37) v1(18.19,84.83) v1(18.19,84) v1(18.19,83.17) v1(18.32,73.71) v1(18.57,87.83) v1(18.57,0.69) v1(18.72,67.63) v1(18.72,66.8) v1(18.72,65.97) v1(18.72,54.48) v1(18.72,53.65) v1(18.98,87.14) v1(19.4,87.83) v1(19.4,68.04) v1(19.4,67.21) v1(19.4,66.39) v1(19.4,65.56) v1(19.4,54.89) v1(19.4,54.07) v1(19.4,53.24) v1(19.41,24.21) v1(19.41,23.39) v1(19.41,22.56) v1(19.66,29.12) v1(19.66,28.3) v1(19.66,27.47) v1(19.81,87.14) v1(20.09,67.63) v1(20.09,66.8) v1(20.09,65.97) v1(20.09,54.48) v1(20.09,53.65) v1(20.09,23.8) v1(20.09,22.97) v1(20.22,87.83) v1(20.34,28.71) v1(20.34,27.88) v1(20.63,87.14) v1(20.77,24.21) v1(20.77,23.39) v1(20.77,22.56) v1(21.18,77.81) v1(21.18,76.98) v1(21.87,78.22) v1(21.87,77.39) v1(21.87,76.57) v1(25.12,90.45) v1(25.12,89.62) v1(25.12,73.56) v1(25.12,72.73) v1(25.12,65.11) v1(25.12,64.28) v1(25.12,56.66) v1(25.12,55.84) v1(25.12,48.22) v1(25.12,47.39) v1(25.81,90.86) v1(25.81,90.04) v1(25.81,89.21) v1(25.81,73.97) v1(25.81,73.14) v1(25.81,72.32) v1(25.81,65.52) v1(25.81,64.7) v1(25.81,63.87) v1(25.81,57.08) v1(25.81,56.25) v1(25.81,55.42) v1(25.81,48.63) v1(25.81,47.8) v1(25.81,46.98) v2(15.34,6.23) v2(15.34,5.4) v2(15.34,4.57) v2(15.34,3.75) v2(16.17,7.05) v2(16.17,6.23) v2(16.17,5.4) v2(16.17,4.57) v2(16.17,3.75) v2(16.99,7.05) v2(16.99,6.23) v2(16.99,5.4) v2(16.99,4.57) v2(16.99,3.75) v2(17.82,7.05) v2(17.82,6.23) v2(17.82,5.4) v2(17.82,4.57) v2(17.82,3.75) v2(18.65,7.05) v2(18.65,5.4) v2(18.65,4.57) v2(18.65,3.75) v3(5.07,12.71) v3(5.07,12.01) v3(5.07,11.31) v3(5.07,10.61) v3(5.75,12.71) v3(5.75,12.01) v3(5.75,11.31) v3(5.75,10.61)
ADC: length 11.9
  Top Layer w0.6: 4.58,64.21 TLV.1 4.58,66.28 arc(4.77,66.74) 5.23,66.93 5.86,66.93 arc(6.3,67.11) 6.48,67.55 TLV.4 ; 8.82,60.97 8.72,61.07 6.93,61.07 SWC.1 6.29,60.97 4.51,62.75 C1.2
AN09_P014: length 57.4
  Top Layer w0.152: v4(19.48,46.91) 19.48,42.88 19.2,42.6 19.2,30.91 21.93,28.18 RA4M1-Zero.4
  Bottom Layer w0.203: v4(19.48,46.91) 19.48,48.84 23.14,52.5 23.14,81.64 VR.2
AN20_P102: length 32.7
  Top Layer w0.152: R4.1 R5.2 10.4,59.54 v4(10.4,59.45) ; v4(11.58,45.77) 11.58,45.81 10.6,46.79 8.28,46.79 7.64,46.15 7.64,42.6 8.15,42.09 8.15,37.26 6.69,35.8 5.48,35.8
  Bottom Layer w0.152: 11.58,45.75 11.58,58.26 v4(10.4,59.45)
BAT+: length 12.1
  Top Layer w0.6: 4.83,8.7 4.83,7.69 6.47,6.05 13.87,6.05 13.97,5.95 C5.2
CHRG: length 12.9
  Top Layer w0.203: R20.2 6.75,1.73 6.75,3.35 8.03,4.62 v4(9.81,4.62) ; v4(9.81,7.67) 9.56,7.42 8.03,7.42 7.37,8.07 7.37,8.7
  Bottom Layer w0.203: v4(9.81,7.67) v4(9.81,4.62)
CS_P112: length 24.3
  Top Layer w0.152: v4(10.82,45.77) 10.18,46.41 8.41,46.41 8.03,46.03 8.03,42.72 8.53,42.22 8.53,35.23 6.56,33.26 TP4.1 ; ICM.12 10.38,50.62 v4(10.82,51.07)
  Bottom Layer w0.152: v4(10.82,45.77) v4(10.82,51.07)
DEBUG_RX: length 10
  Top Layer w0.203: RA4M1-Zero.21 17.8,37.69 17.8,41.83 15.55,44.09 15.55,44.37
DEBUG_TX: length 11.9
  Top Layer w0.203: 18.09,44.37 18.31,44.15 18.31,35.65 RA4M1-Zero.20
ENCA: length 67.7
  Top Layer w0.152: v4(19.97,46.4) 19.97,42.85 19.58,42.47 19.58,33.07 21.93,30.72 RA4M1-Zero.5
  Top Layer w0.203: v4(6.88,78.41) 5.57,78.41 5.54,78.38
  Bottom Layer w0.203: v4(19.97,46.4) 18.57,46.4 18.19,46.79 18.19,48.82 22.12,52.76 22.12,74.98 18.69,78.41 v4(6.88,78.41)
ENCB: length 68
  Top Layer w0.152: v4(20.47,45.9) 20.47,42.85 19.96,42.34 19.96,35.23 21.93,33.26 23.08,33.26
  Top Layer w0.203: v4(6.88,74.38) 5.54,74.38
  Bottom Layer w0.203: v4(20.47,45.9) 20.47,45.9 18.44,45.9 17.68,46.66 17.68,48.95 21.61,52.88 21.61,74.85 18.57,77.9 8.03,77.9 6.88,76.76 6.88,74.35
FULL: length 12.5
  Top Layer w0.203: v4(10.44,6.91) 7.01,6.91 6.1,7.82 6.1,8.7 ; R21.2 7.59,5.26 v4(10.44,5.26)
  Bottom Layer w0.203: v4(10.44,6.91) v4(10.44,5.26)
GTIOC2A_P103: length 73.2
  Top Layer w0.152: v4(18.82,46.91) 18.82,46.03 18.19,45.39 12.79,45.39 11.01,47.17 8.15,47.17 7.26,46.28 7.26,42.47 7.77,41.96 7.77,39.55 6.56,38.34 RA4M1-Zero.11
  Top Layer w0.203: Q2.1 15.21,88.82 v4(16.03,88.82)
  Bottom Layer w0.203: v4(16.03,88.82) 20.47,88.82 21.74,87.55 21.74,81.08 22.63,80.19 22.63,52.63 18.82,48.82 v4(18.82,46.91)
HC06_RX: length 24.5
  Top Layer w0.203: v4(9.8,19.86) 9.11,20.56 TP8.1
  Bottom Layer w0.203: 7.78,2.6 7.79,2.59 8.91,2.59 11.03,4.71 11.03,7.46 9.68,8.81 9.68,19.74 v4(9.8,19.86)
HC06_TX: length 28.2
  Top Layer w0.203: v4(10.69,19.86) 8.15,22.4 6.18,22.4 TP7.1
  Bottom Layer w0.203: 7.78,1.1 8.82,1.1 11.45,3.73 11.45,7.67 10.18,8.94 10.18,18.29 10.69,18.8 v4(10.69,19.86)
ICM42688_INT1: length 9.5
  Top Layer w0.152: ICM.4 6.88,46.83 6.88,41.33 6.44,40.88 5.48,40.88
ICM42688_SCK: length 29.2
  Top Layer w0.152: v4(9.88,49.71) ICM.13 9.88,51.71 R12.2 ; v4(10.06,45.77) 9.3,45.01 9.3,42.98 9.68,42.6 9.68,28.75 6.56,25.64 TP3.1
  Bottom Layer w0.152: v4(10.06,45.77) 10.06,46.41 9.88,46.59 v4(9.88,49.71)
ICM42688_SDI: length 25.5
  Top Layer w0.152: ICM.14 9.38,51.15 R11.2 ; TP2.1 6.56,30.72 8.91,33.07 8.91,42.34 8.53,42.72 v4(8.53,45.77)
  Bottom Layer w0.152: v4(8.53,45.77) 8.53,49.8 8.28,50.05 8.28,51.49 v4(8.66,51.87)
ICM42688_SDO: length 28.1
  Top Layer w0.152: ICM.1 8.79,50.06 v4(8.79,50.72) 8.57,50.72 7.42,51.88 R10.2 ; TP1.1 6.56,28.18 9.3,30.91 9.3,42.47 8.91,42.85 8.91,45.39 v4(9.3,45.77)
  Bottom Layer w0.152: v4(8.79,50.72) 9.3,50.22 v4(9.3,45.77)
IRQ00_P105: length 67.9
  Top Layer w0.152: RA4M1-Zero.27 11.33,34.57 11.33,42.37 v4(11.68,42.72)
  Top Layer w0.203: v4(10.82,77.14) v4(10.82,81.46) ; v4(10.82,85.01) 9.17,85.01 8.28,85.9 8.28,89.6 R16.2 7.46,91.87 C11.2 7.41,93.62 KEY1.1
  Bottom Layer w0.203: v4(10.82,77.14) 10.82,76 11.07,75.74 11.07,59.36 13.1,57.33 13.1,46.03 11.71,44.63 11.71,42.75 v4(11.68,42.72) ; v4(10.82,81.46) v4(10.82,85.01)
IRQ02_P002: length 53.2
  Top Layer w0.152: v4(20.98,45.39) 20.98,42.85 20.34,42.22 20.34,37.39 21.93,35.8 23.08,35.8
  Bottom Layer w0.203: TRIG.1 19.73,76.1 21.11,74.73 21.11,53.01 17.17,49.07 17.17,46.53 18.31,45.39 v4(20.98,45.39)
IRQ09_P304: length 54
  Top Layer w0.152: v4(13.87,40.82) 13.87,39.94 RA4M1-Zero.25
  Top Layer w0.203: v4(11.58,77.14) 11.58,81.57 KEY2.1 7.41,85.74 C12.2 7.46,87.48 R17.2
  Bottom Layer w0.203: v4(11.58,77.14) 11.58,59.49 13.54,57.52 13.54,45.97 14.25,45.26 14.25,42.47 13.87,42.09 v4(13.87,40.82)
LED1: length 70.3
  Top Layer w0.203: v4(14.63,40.82) 14.63,38.93 12.45,36.75 RA4M1-Zero.26 ; R18.2 21.61,96.78 v4(21.61,89.59)
  Bottom Layer w0.203: v4(14.63,40.82) 16.28,42.47 19.84,42.47 24.15,46.79 24.15,79.93 24.87,80.65 24.87,82.65 22.76,84.76 22.76,88.44 v4(21.61,89.59)
LED2: length 67.3
  Top Layer w0.203: v4(21.61,88.67) 20.98,89.31 20.98,95.08 R19.2 ; v4(14.63,41.71) 12.45,41.71 RA4M1-Zero.24
  Bottom Layer w0.203: v4(14.63,41.71) 15.77,42.85 19.58,42.85 23.65,46.91 23.65,80.06 24.41,80.82 24.41,82.47 22.25,84.63 22.25,88.04 v4(21.61,88.67)
QMC5883P_SCL: length 11.5
  Top Layer w0.152: TP5.1 22.12,40.88 22.12,48.55 R13.1 21.25,49.31 20.5,48.56 QMC.1
QMC5883P_SDA: length 13.7
  Top Layer w0.152: TP6.1 22.06,38.34 20.72,39.67 20.72,42.09 21.55,42.91 21.55,47.75 R14.1 19.46,47.93 QMC.16
SWCLK: length 9.2
  Top Layer w0.203: RA4M1-Zero.22 17.3,39.72 17.3,41.61 16.05,42.85 14.25,42.85 13.01,44.09 13.01,44.37
SWDIO: length 7
  Top Layer w0.203: 10.47,44.37 10.82,44.37 12.85,42.34 14.83,42.34 RA4M1-Zero.23
$1N2884: length 1.8
  Top Layer w0.249: QMC.10 16.85,49.56 C10.1
$1N4731: length 15.1
  Bottom Layer w0.152: HC06_S.2 23.14,18.85 22.63,18.34 19.2,18.34 18.82,17.96 18.82,14.02 19.76,13.09 20.78,13.09
  Bottom Layer w0.203: R9.1 20.78,13.09
$1N4735: length 2.4
  Bottom Layer w0.203: 20.78,16.09 R8.2
$1N4784: length 1.5
  Bottom Layer w0.203: R8.1 24.61,17.59 LED.2
$1N6031:
  vias: v2(8.59,58.41) v2(8.59,57.58) v2(9.42,58.41) v2(9.42,57.58) v2(9.42,56.75) v2(10.25,58.41) v2(10.25,57.58) v2(10.25,56.75) v2(16.09,11.55) v2(16.09,10.72) v2(16.92,12.37) v2(16.92,11.55) v2(16.92,10.72) v2(17.75,12.37) v2(17.75,11.55) v2(17.75,10.72) v2(18.57,12.37) v2(18.57,11.55) v2(18.57,10.72)
$1N6033: length 1.5
  Top Layer w0.203: R3.1 3.07,65.83
$1N6047: length 1.4
  Top Layer w0.203: FULL.1 4.53,5.05 R21.1
$1N6048: length 1.4
  Top Layer w0.203: R20.1 4.53,2.36 CHRG.1
$1N6051: length 1.5
  Top Layer w0.6: 7.37,14.7 7.37,16.19
$1N14788: length 2.2
  Top Layer w0.203: TRIG.2 15.03,60.75 R15.1
$1N15083: length 1.4
  Top Layer w0.203: LED2.1 20.15,97.5 20.11,97.45
$1N15087: length 1.4
  Top Layer w0.203: LED1.1 23.84,97.5 R18.1
$1N22954: length 4.5
  Top Layer w0.701: M.1 12.65,87.4 13.3,88.05 Q2.2

## Copper pours and planes (outline as drawn; the poured copper is in the pictures)
3V3 on Top Layer: 12.09,46.79 12.98,46.79 13.1,46.91 13.1,48.95 12.98,49.07 12.09,49.07 11.71,48.69 10.69,48.69 10.69,47.62 10.7,47.61 11.27,47.61
3V3 on Top Layer: 6.75,69.14 7.26,68.63 7.26,67.49 7.52,67.23 9.42,67.23 9.68,67.49 9.68,69.01 8.53,70.16 5.87,70.16 5.74,70.03 5.74,69.27 5.87,69.14
5V on Top Layer: 27.84,0.18 27.84,18.59 24.79,21.64 21.11,21.64 18.82,19.35 5.23,19.35 4.22,18.34 4.22,13.89 4.34,13.77 5.1,13.77 5.36,14.02 5.36,17.96 5.74,18.34 17.04,18.34 18.82,16.56 18.82,13.77 19.33,13.26 20.98,13.26 22.25,11.99 22.25,9.7 21.87,9.32 20.98,9.32 20.34,8.69 20.34,4.67 21.6,3.42 21.6,0.45 21.87,0.18
GND on Top Layer: -0.74,106.22 30.38,106.22 30.38,-9.47 -0.74,-9.47
GND on Bottom Layer: -0.87,105.72 30.5,105.72 30.5,-9.85 -0.87,-9.85
BAT+ on Top Layer: 12.22,0.43 12.47,0.18 14.38,0.18 14.63,0.43 14.63,6.4 16.03,7.8 19.46,7.8 19.84,8.18 19.84,9.45 19.46,9.83 13.74,9.83 12.22,8.31
$1N6030 on Top Layer: 9.3,64.95 9.68,65.33 9.68,66.34 9.55,66.47 6.37,66.47 6.12,66.22 6.12,65.08 6.25,64.95
$1N6031 on Top Layer: 8.15,59.11 8.41,58.85 10.44,58.85 10.69,58.6 10.69,56.57 10.44,56.31 9.17,56.31 7.9,57.58 5.74,57.58 5.49,57.84 5.49,58.98 5.61,59.11
$1N6031 on Top Layer: 20.85,13 22,11.86 22,9.83 21.74,9.58 20.09,9.58 19.58,10.08 16.03,10.08 15.65,10.47 15.65,11.74 16.91,13
$1N6031 on Bottom Layer: 6.5,44.12 15.65,34.98 15.65,10.47 16.03,10.08 18.69,10.08 19.01,10.4 19.01,13.32 18.44,13.89 18.44,35.74 8.03,46.15 8.03,51.87 10.69,54.53 10.69,58.6 10.31,58.98 8.41,58.98 8.03,58.6 8.03,55.42 6.5,53.9
$1N6032 on Top Layer: 5.36,71.42 5.23,71.55 4.34,71.55 4.22,71.42 4.22,67.61 4.34,67.49 4.98,67.49 5.36,67.87

Small or netless copper shapes (teardrops, artwork), in the pictures only: 145 on Top Layer, 65 on Bottom Layer

## Text on the board
Bottom Silkscreen Layer: v1.1 | Designed by WilliTourt | Renesas HandSync Project - Controller
Top Silkscreen Layer: Y | Z | X
